# Altium schematic sheet Experiment 3 0.0.0.SchDoc
size A4; Organization: Altium Limited; Address1: L3, 12a Rodborough Rd; Address2: Frenchs Forest; Address3: NSW; Address4: Australia 2086; DocumentNumber: 3; SheetNumber: 3; SheetTotal: 5
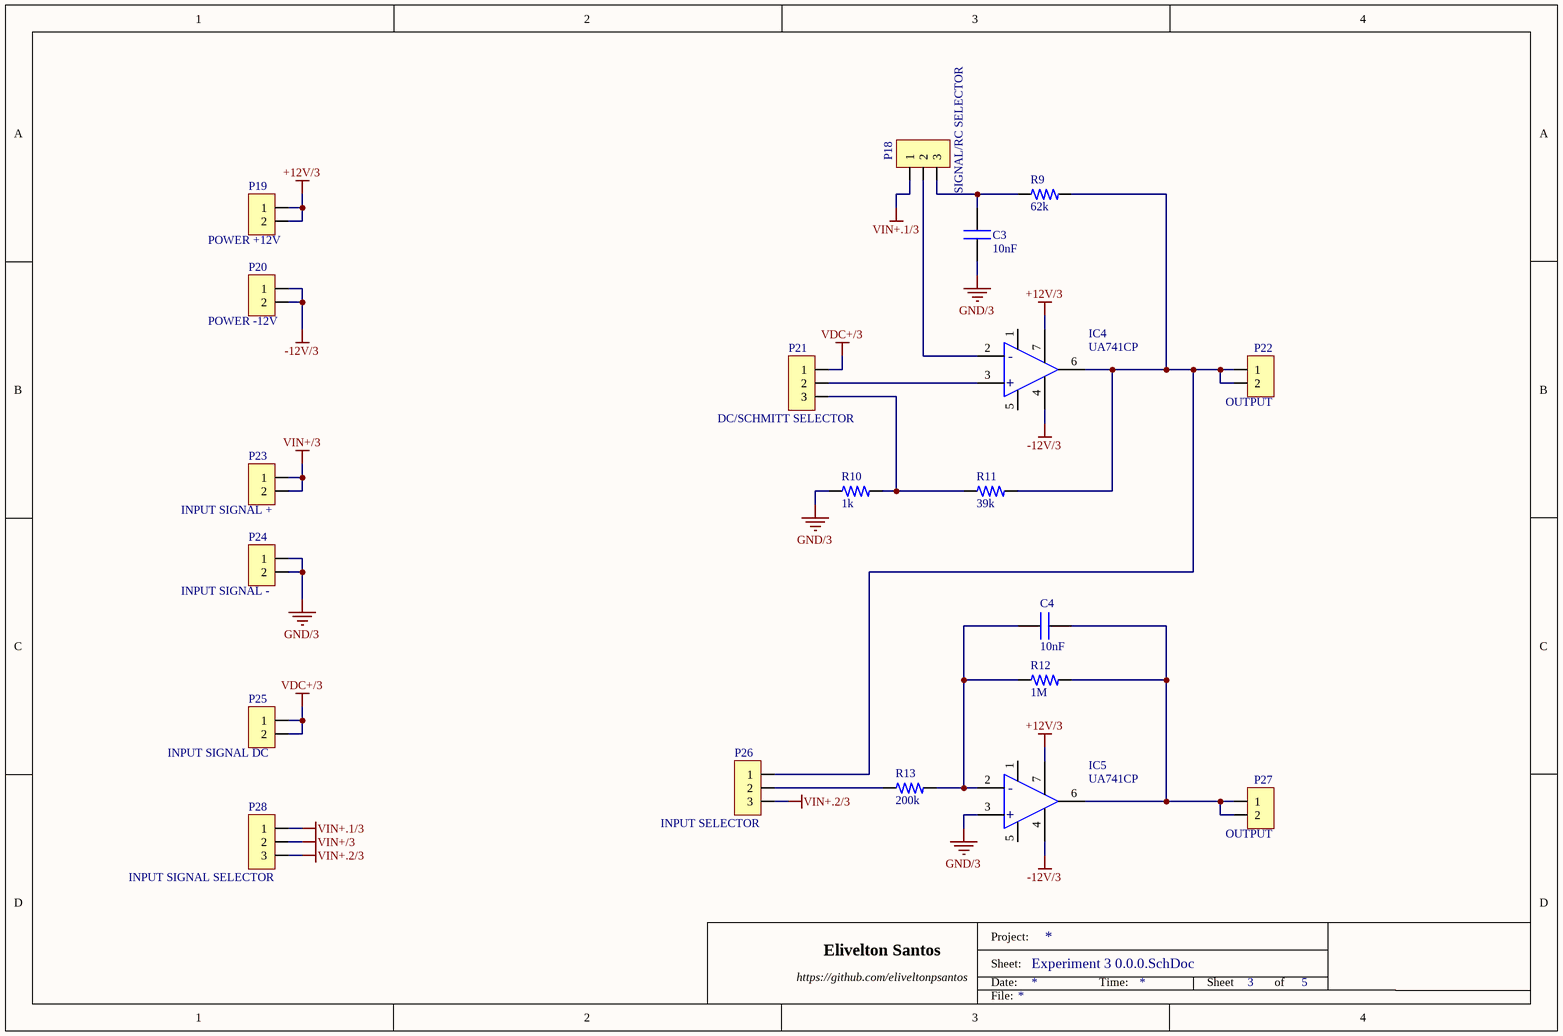
[diagram p0: Experiment 3 0.0.0.SchDoc]

## Parts
C3  10nF  [CAP-H5]
C4  10nF  [CAP-H5]
IC4  UA741CP  [DIP-8]
IC5  UA741CP  [DIP-8]
P18  SIGNAL/RC SELECTOR  [PINHD-1X03]
P19  POWER +12V  [PINHD-1X02 ONCE]
P20  POWER -12V  [PINHD-1X02 ONCE]
P21  DC/SCHMITT SELECTOR  [PINHD-1X03]
P22  OUTPUT  [PINHD-1X02 ONCE]
P23  INPUT SIGNAL +  [PINHD-1X02 ONCE]
P24  INPUT SIGNAL -  [PINHD-1X02 ONCE]
P25  INPUT SIGNAL DC  [PINHD-1X02 ONCE]
P26  INPUT SELECTOR  [PINHD-1X03]
P27  OUTPUT  [PINHD-1X02 ONCE]
P28  INPUT SIGNAL SELECTOR  [PINHD-1X03]
R9  62k  [R Axial 0.25]
R10  1k  [R Axial 0.25]
R11  39k  [R Axial 0.25]
R12  1M  [R Axial 0.25]
R13  200k  [R Axial 0.25]

## Nets
+12V/3: IC4.7(VCC+) IC5.7(VCC+) P19.1 P19.2
-12V/3: IC4.4(VCC-) IC5.4(VCC-) P20.1 P20.2
GND/3: C3.1 IC5.3(+) P24.1 P24.2 R10.1
VDC+/3: P21.1 P25.1 P25.2
VIN+.1/3: P18.1 P28.1
VIN+.2/3: P26.3 P28.3
VIN+/3: P23.1 P23.2 P28.2
NetC3_2: C3.2 P18.3 R9.1
NetC4_1: C4.1 IC5.6(OUTPUT) P27.1 P27.2 R12.2
NetC4_2: C4.2 IC5.2(-) R12.1 R13.2
NetIC4_2: IC4.2(-) P18.2
NetIC4_3: IC4.3(+) P21.2
NetIC4_6: IC4.6(OUTPUT) P22.1 P22.2 P26.1 R9.2 R11.2
NetP21_3: P21.3 R10.2 R11.1
NetP26_2: P26.2 R13.1

Not connected (* = marked no-connect by the designer): IC4 1(OFFSET1) 5(OFFSET2); IC5 1(OFFSET1) 5(OFFSET2)

## Notes on the sheet
- Elivelton Santos
- https://github.com/eliveltonpsantos
- Project:
- Sheet:
- Date:
- Time:
- Sheet
- of
- File:

## Library data of the parts
C3 C4 = K103K10X7RF5UH5: CAP CER 10000PF 50V X7R RADIAL; Manufacturer: Vishay BC Components; Manufacturer Part Number: K101K10X7RF5UH5; Tolerance: ±10%; Category: Capacitors; Package / Case: 0.142" L x 0.091" W (3.60mm x 2.30mm); Capacitance: 10nF; Voltage: 50V; Supplier 1: Digi-Key; Supplier Part Number 1: BC2662CT-ND
IC4 IC5 = UA741CP: IC OPAMP GP 1MHZ 8DIP; Manufacturer: Texas Instruments; Category: ICs; Manufacturer Part Number: UA741CP; Package / Case: 8-PDIP; Supplier 1: Digi-Key; Supplier Part Number 1: 296-11107-5-ND
P18 P21 P26 P28 = PIN HEADER 1X03: CONN HEADER 3POS .100" STR TIN; Manufacturer: Molex, LLC; Manufacturer Part Number: 0901200123; Category: Connectors; Supplier 1: Digi-Key; Supplier Part Number 1: WM8073-ND
P19 P20 P22-P25 P27 = PIN HEADER 1X02 ONCE: CONN HEADER 2POS .100" STR TIN; Manufacturer: Molex, LLC; Manufacturer Part Number: 0901200122; Category: Connectors; Supplier 1: Digi-Key; Supplier Part Number 1: WM8072-ND
R9 = CFR-25JB-52-62K: RES 62K OHM 1/4W 5% AXIAL; Manufacturer: Yageo; Power (Watts): 0.25W, 1/4W; Category: Resistors; Manufacturer Part Number: CFR-25JB-52-62K; Package / Case: Axial; Resistance (Ohms): 62k; Tolerance: ±5%; Supplier 1: Digi-Key; Supplier Part Number 1: 62KQBK-ND
R10 = CFR-25JB-52-1K: RES 1K OHM 1/4W 5% AXIAL; Manufacturer: Yageo; Power (Watts): 0.25W, 1/4W; Category: Resistors; Manufacturer Part Number: CFR-25JB-52-1K; Package / Case: Axial; Resistance (Ohms): 1k; Tolerance: ±5%; Supplier 1: Digi-Key; Supplier Part Number 1: 1.0KQBK-ND
R11 = CFR-25JB-52-39K: RES 39K OHM 1/4W 5% AXIAL; Manufacturer: Yageo; Power (Watts): 0.25W, 1/4W; Category: Resistors; Manufacturer Part Number: CFR-25JB-52-39K; Package / Case: Axial; Resistance (Ohms): 39k; Tolerance: ±5%; Supplier 1: Digi-Key; Supplier Part Number 1: 39KQBK-ND
R12 = CFR-25JB-52-1M: RES 1M OHM 1/4W 5% AXIAL; Manufacturer: Yageo; Power (Watts): 0.25W, 1/4W; Category: Resistors; Manufacturer Part Number: CFR-25JB-52-1M; Package / Case: Axial; Resistance (Ohms): 1M; Tolerance: ±5%; Supplier 1: Digi-Key; Supplier Part Number 1: 1.0MQBK-ND
R13 = CFR-25JB-52-200K: RES 200K OHM 1/4W 5% AXIAL; Manufacturer: Yageo; Power (Watts): 0.25W, 1/4W; Category: Resistors; Manufacturer Part Number: CFR-25JB-52-200K; Package / Case: Axial; Resistance (Ohms): 200k; Tolerance: ±5%; Supplier 1: Digi-Key; Supplier Part Number 1: 200KQBK-ND